# EAGLE schematic Schematic_v2_2 (EAGLE 9.6.2)
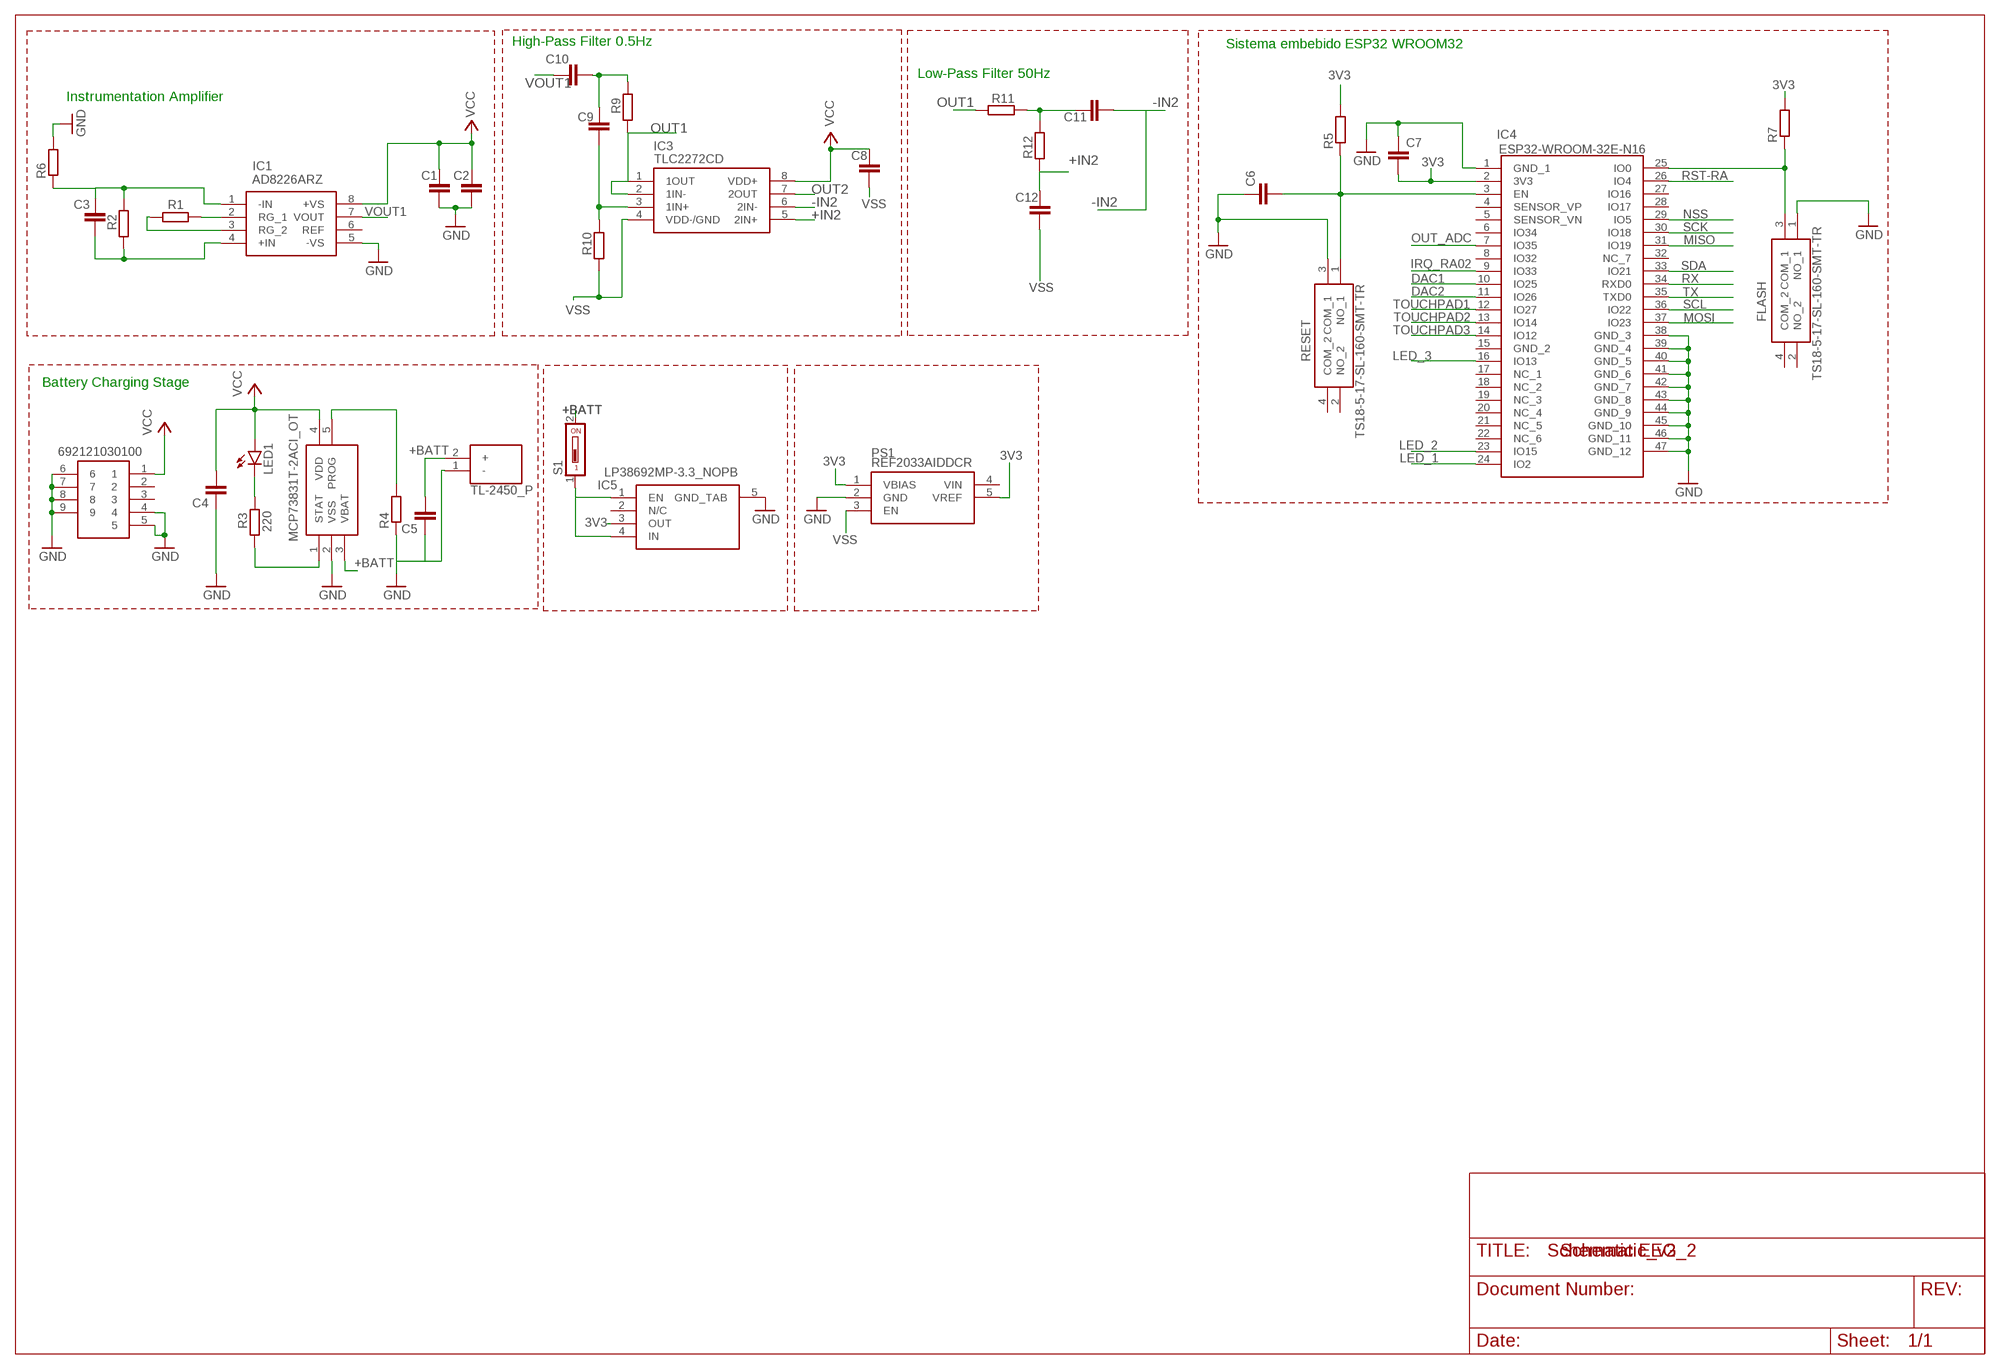
[diagram p0: schematic, sheet 1]

## Parts
BT1  TL-2450_P  [TL2450P]
C1  C-EUC0805  [C0805]
C2  C-EUC0805  [C0805]
C3  C-EUC0805  [C0805]
C4  C-EUC0805  [C0805]
C5  C-EUC0805  [C0805]
C6  C-EUC0805  [C0805]
C7  C-EUC0805  [C0805]
C8  C-EUC0805  [C0805]
C9  C-EUC0805  [C0805]
C10  C-EUC0805  [C0805]
C11  C-EUC0805  [C0805]
C12  C-EUC0805  [C0805]
FLASH  TS18-5-17-SL-160-SMT-TR  [TS18517SL160SMTTR]
IC1  AD8226ARZ  [SOIC127P600X175-8N]
IC2  MCP73831T-2ACI_OT  [SOT95P270X145-5N]
IC3  TLC2272CD  [SOIC127P600X175-8N]
IC4  ESP32-WROOM-32E-N16  [ESP32WROOM32EN16]
IC5  LP38692MP-3.3_NOPB  [SOT150P700X180-5N]
J1  692121030100  [692121030100]
LED1  LEDCHIP-LED0805  [CHIP-LED0805]
PS1  REF2033AIDDCR  [SOT95P280X110-5N]
R1  R-EU_R0805  [R0805]
R2  R-EU_R0805  [R0805]
R3  220  R-EU_R0805  [R0805]
R4  R-EU_R0805  [R0805]
R5  R-EU_R0805  [R0805]
R6  R-EU_R0805  [R0805]
R7  R-EU_R0805  [R0805]
R9  R-EU_R0805  [R0805]
R10  R-EU_R0805  [R0805]
R11  R-EU_R0805  [R0805]
R12  R-EU_R0805  [R0805]
RESET  TS18-5-17-SL-160-SMT-TR  [TS18517SL160SMTTR]
S1  DS01  [DS-01]

## Nets
3V3: C7.2 IC4.2(3V3) IC5.3(OUT) PS1.1(VBIAS) PS1.5(VREF) R5.2 R7.2
+BATT: BT1.2(+) C5.2 IC2.3(VBAT) S1.2
+IN2: C12.1 IC3.5(2IN+) R12.1
-IN2: C11.2 IC3.6(2IN-)
DAC1: IC4.10(IO25)
DAC2: IC4.11(IO26)
GND: C1.2 C2.2 C4.1 C6.1 C7.1 FLASH.1(NO_1) IC1.5(-VS) IC2.2(VSS) IC4.1(GND_1) IC4.38(GND_3) IC4.39(GND_4) IC4.40(GND_5) IC4.41(GND_6) IC4.42(GND_7) IC4.43(GND_8) IC4.44(GND_9) IC4.45(GND_10) IC4.46(GND_11) IC4.47(GND_12) IC5.5(GND_TAB) J1.4 J1.5 J1.6 J1.7 J1.8 J1.9 PS1.2(GND) R4.1 R6.2 RESET.3(COM_1)
IRQ_RA02: IC4.9(IO33)
LED_1: IC4.24(IO2)
LED_2: IC4.23(IO15)
LED_3: IC4.16(IO13)
MISO: IC4.31(IO19)
MOSI: IC4.37(IO23)
N$1: IC1.2(RG_1) R1.2
N$2: IC1.3(RG_2) R1.1
N$3: C3.1 IC1.1(-IN) R2.2 R6.1
N$4: C3.2 IC1.4(+IN) R2.1
N$5: C11.1 R11.2 R12.2
N$6: IC2.1(STAT) R3.1
N$7: IC2.5(PROG) R4.2
N$8: LED1.C R3.2
N$10: FLASH.3(COM_1) IC4.25(IO0) R7.1
N$11: C6.2 IC4.3(EN) R5.1 RESET.1(NO_1)
N$12: C9.2 IC3.3(1IN+) R10.2
N$13: IC5.4(IN) S1.1
N$14: C5.1
N$15: IC5.1(EN)
N$16: BT1.1(-)
NSS: IC4.29(IO5)
OUT1: IC3.1(1OUT) IC3.2(1IN-) R9.1 R11.1
OUT2: C9.1 C10.2 IC3.7(2OUT) R9.2
OUT_ADC: IC4.7(IO35)
RST-RA: IC4.26(IO4)
RX: IC4.34(RXD0)
SCK: IC4.30(IO18)
SCL: IC4.36(IO22)
SDA: IC4.33(IO21)
TOUCHPAD1: IC4.12(IO27)
TOUCHPAD2: IC4.13(IO14)
TOUCHPAD3: IC4.14(IO12)
TX: IC4.35(TXD0)
VCC: C1.1 C2.1 C4.2 C8.1 IC1.8(+VS) IC2.4(VDD) IC3.8(VDD+) J1.1 LED1.A
VOUT1: C10.1 IC1.7(VOUT)
VSS: C8.2 C12.2 IC3.4(VDD-/GND) PS1.3(EN) R10.1
Unconnected: FLASH.2(NO_2) FLASH.4(COM_2) IC1.6(REF) IC4.4(SENSOR_VP) IC4.5(SENSOR_VN) IC4.6(IO34) IC4.8(IO32) IC4.15(GND_2) IC4.17(NC_1) IC4.18(NC_2) IC4.19(NC_3) IC4.20(NC_4) IC4.21(NC_5) IC4.22(NC_6) IC4.27(IO16) IC4.28(IO17) IC4.32(NC_7) IC5.2(N/C) J1.2 J1.3 RESET.2(NO_2) RESET.4(COM_2)

## Notes on the sheet
- High-Pass Filter 0.5Hz | Sistema embebido ESP32 WROOM32
- Low-Pass Filter 50Hz
- Instrumentation Amplifier
- Battery Charging Stage
- Schematic EEG

## Power pins joined to a net without a drawn wire
VIN: PS1.4(VIN)

## Library data of the parts
BT1 = TL-2450_P:TL-2450_P: Lithium Battery Coin 3.6V 550mAh Primary Automotive Through Hole Source: Datasheet <https://datasheet.datasheetarchive.com/originals/distributors/Datasheets-DGA19/42266.pdf>; ARROW_PART_NUMBER: TL-2450/P; ARROW_PRICE-STOCK: http://www.arrow.com/en/products/tl-2450p/tadiran-batteries; DESCRIPTION: Lithium Battery Coin 3.6V 550mAh Primary Automotive Through Hole; HEIGHT: 5.8mm; MANUFACTURER_NAME: Tadiran Batteries; MANUFACTURER_PART_NUMBER: TL-2450/P
C1-C12 = rcl:C-EU: CAPACITOR, European symbol; SPICEPREFIX: C
FLASH RESET = TS18-5-17-SL-160-SMT-TR:TS18-5-17-SL-160-SMT-TR: 5 x 5 mm, 1.7 mm Actuator Height, 160 gf, Silver, Surface Mount, TR, SPST, Tactile Switch Source: Datasheet <https://www.sameskydevices.com/product/resource/supplyframepdf/ts18.pdf>; DESCRIPTION: 5 x 5 mm, 1.7 mm Actuator Height, 160 gf, Silver, Surface Mount, TR, SPST, Tactile Switch; HEIGHT: 1.8mm; MANUFACTURER_NAME: Same Sky; MANUFACTURER_PART_NUMBER: TS18-5-17-SL-160-SMT-TR; MOUSER_PART_NUMBER: 179-TS18517SL160SMTT; MOUSER_PRICE-STOCK: https://www.mouser.co.uk/ProductDetail/CUI-Devices/TS18-5-17-SL-160-SMT-TR?qs=tlsG%2FOw5FFhWy38y3t272A%3D%3D
IC1 = AD8226ARZ:AD8226ARZ: Wide Supply Range, Rail-to-Rail Output Instrumentation Amplifier Source: Datasheet <http://componentsearchengine.com/Datasheets/3/AD8226ARZ.pdf>; DESCRIPTION: Wide Supply Range, Rail-to-Rail Output Instrumentation Amplifier; HEIGHT: 1.75mm; MANUFACTURER_NAME: Analog Devices; MANUFACTURER_PART_NUMBER: AD8226ARZ; MOUSER_PART_NUMBER: 584-AD8226ARZ; MOUSER_PRICE-STOCK: https://www.mouser.co.uk/ProductDetail/Analog-Devices/AD8226ARZ?qs=%2FtpEQrCGXCzihJADRPlhCg%3D%3D
IC2 = MCP73831T-2ACI_OT:MCP73831T-2ACI_OT: Li-Ion Charge Controller 4.2V SOT23-5 Source: Datasheet <http://ww1.microchip.com/downloads/en/DeviceDoc/20001984g.pdf>; ARROW_PART_NUMBER: MCP73831T-2ACI/OT; ARROW_PRICE-STOCK: https://www.arrow.com/en/products/mcp73831t-2aciot/microchip-technology?utm_currency=USD&region=nac; DESCRIPTION: Li-Ion Charge Controller 4.2V SOT23-5; HEIGHT: 1.45mm; MANUFACTURER_NAME: Microchip; MANUFACTURER_PART_NUMBER: MCP73831T-2ACI/OT; MOUSER_PART_NUMBER: 579-MCP73831T-2ACIOT; MOUSER_PRICE-STOCK: https://www.mouser.co.uk/ProductDetail/Microchip-Technology/MCP73831T-2ACI-OT?qs=yUQqVecv4qvbBQBGbHx0Mw%3D%3D
IC3 = TLC2272CD:TLC2272CD: Dual, Low-Noise, Rail-To-Rail Operational Amplifier Source: Datasheet <http://www.ti.com/lit/ds/symlink/tlc2272.pdf>; DESCRIPTION: Dual, Low-Noise, Rail-To-Rail Operational Amplifier; HEIGHT: 1.75mm; MANUFACTURER_NAME: Texas Instruments; MANUFACTURER_PART_NUMBER: TLC2272CD; MOUSER_PART_NUMBER: 595-TLC2272CD; MOUSER_PRICE-STOCK: https://www.mouser.co.uk/ProductDetail/Texas-Instruments/TLC2272CD?qs=JHHQeKcAU3DCCrMZYsil2w%3D%3D
IC4 = ESP32-WROOM-32E-N16:ESP32-WROOM-32E-N16: Bluetooth, WiFi 802.11b/g/n, Bluetooth v4.2 +EDR, Class 1, 2 and 3 Transceiver Module 2.4GHz ~ 2.5GHz Integrated, Trace Surface Mount Source: Datasheet <https://www.espressif.com/sites/default/files/documentation/esp32-wroom-32e_esp32-wroom-32ue_datasheet_en.pdf>; DESCRIPTION: Bluetooth, WiFi 802.11b/g/n, Bluetooth v4.2 +EDR, Class 1, 2 and 3 Transceiver Module 2.4GHz ~ 2.5GHz Integrated, Trace Surface Mount; HEIGHT: 3.25mm; MANUFACTURER_NAME: Espressif Systems; MANUFACTURER_PART_NUMBER: ESP32-WROOM-32E-N16; MOUSER_PART_NUMBER: 356-ESP32WRM32E128PH; MOUSER_PRICE-STOCK: https://www.mouser.co.uk/ProductDetail/Espressif-Systems/ESP32-WROOM-32E-N16?qs=Li%252BoUPsLEnsC4cA%252BUYB2Bw%3D%3D
IC5 = LP38692MP-3.3_NOPB:LP38692MP-3.3_NOPB: LP38692MP-3.3/NOPB, Low Dropout Voltage Regulator, 1A, 3.3 V +/-2.5%, 2.7 10 Vin, 5-Pin SOT-223 Source: Datasheet <http://www.ti.com/lit/ds/symlink/lp38692.pdf>; DESCRIPTION: LP38692MP-3.3/NOPB, Low Dropout Voltage Regulator, 1A, 3.3 V +/-2.5%, 2.7 10 Vin, 5-Pin SOT-223; HEIGHT: 1.8mm; MANUFACTURER_NAME: Texas Instruments; MANUFACTURER_PART_NUMBER: LP38692MP-3.3/NOPB; MOUSER_PART_NUMBER: 926-LP38692MP3.3NOPB; MOUSER_PRICE-STOCK: https://www.mouser.co.uk/ProductDetail/Texas-Instruments/LP38692MP-3.3-NOPB?qs=1FNqv8aZn1TpKuOP2NKBdg%3D%3D
J1 = 692121030100:692121030100: WR-COM USB 3.0 Connector A horizontal Wurth Elektronik WR-COM Series, Right Angle Version 3.0 Type A USB Connector, Through Hole Socket, 30 V ac, 0.25A Source: Datasheet <https://datasheet.datasheetarchive.com/originals/distributors/Datasheets_SAMA/3db0012f6a0c115a48193fa8a30716eb.pdf>; DESCRIPTION: WR-COM USB 3.0 Connector A horizontal Wurth Elektronik WR-COM Series, Right Angle Version 3.0 Type A USB Connector, Through Hole Socket, 30 V ac, 0.25A; HEIGHT: mm; MANUFACTURER_NAME: Wurth Elektronik; MANUFACTURER_PART_NUMBER: 692121030100; MOUSER_PART_NUMBER: 710-692121030100; MOUSER_PRICE-STOCK: https://www.mouser.co.uk/ProductDetail/Wurth-Elektronik/692121030100?qs=e5m3IbTHPW%252BzU%252B9ZpCsp%2Fg%3D%3D
LED1 = led:LED: LED OSRAM: - CHIPLED LG R971, LG N971, LY N971, LG Q971, LY Q971, LO R971, LY R971 LH N974, LH R974 LS Q976, LO Q976, LY Q976 LO Q996 - Hyper CHIPLED LW Q18S LB Q993, LB Q99A, LB R99A - SideLED LS A670, LO A670, LY A670, LG A670, LP A670 LB A673, LV A673, LT A673, LW A673 LH A674 LY A675 LS A676, LA A676, LO A676, LY A676, LW A676 LS A679, LY A679, LG A679 - Hyper Micro SIDELED® LS Y876, LA Y876, LO Y876, LY Y876 LT Y87S - SmartLED LW L88C, LW L88S LB L89C, LB L89S, LG L890 LS L89K, LO L89K, LY L89K LS L896, LA L896, LO L896, LY L896 - TOPLED LS T670, LO T670, LY T670, LG T670, LP T670 LSG T670, LSP T670, LSY T670, LOP T670, LYG T670 LG T671, LOG T671, LSG T671 LB T673, LV T673, LT T673, LW T673 LH T674 LS T676, LA T676, LO T676, LY T676, LB T676, LH T676, LSB T676, LW T676 LB T67C, LV T67C, LT T67C, LS T67K, LO T67K, LY T67K, LW E67C LS E67B, LA E67B, LO E67B, LY E67B, LB E67C, LV E67C, LT E67C LW T67C LS T679, LY T679, LG T679 LS T770, LO T770, LY T770, LG T770, LP T770 LB T773, LV T773, LT T773, LW T773 LH T774 LS E675, LA E675, LY E675, LS T675 LS T776, LA T776, LO T776, LY T776, LB T776 LHGB T686 LT T68C, LB T68C - Hyper Mini TOPLED® LB M676 - Mini TOPLED Santana® LG M470 LS M47K, LO M47K, LY M47K Source: http://www.osram.convergy.de LUXEON: - LUMILED® LXK2-PW12-R00, LXK2-PW12-S00, LXK2-PW14-U00, LXK2-PW14-V00 LXK2-PM12-R00, LXK2-PM12-S00, LXK2-PM14-U00 LXK2-PE12-Q00, LXK2-PE12-R00, LXK2-PE12-S00, LXK2-PE14-T00, LXK2-PE14-U00 LXK2-PB12-K00, LXK2-PB12-L00, LXK2-PB12-M00, LXK2-PB14-N00, LXK2-PB14-P00, LXK2-PB14-Q00 LXK2-PR12-L00, LXK2-PR12-M00, LXK2-PR14-Q00, LXK2-PR14-R00 LXK2-PD12-Q00, LXK2-PD12-R00, LXK2-PD12-S00 LXK2-PH12-R00, LXK2-PH12-S00 LXK2-PL12-P00, LXK2-PL12-Q00, LXK2-PL12-R00 Source: www.luxeon.com KINGBRIGHT: KA-3528ASYC Source: www.kingbright.com
PS1 = REF2033AIDDCR:REF2033AIDDCR: Low-Drift, Low-Power, Dual-Output Vref and Vref/2 Voltage Reference Source: Datasheet <http://www.ti.com/lit/ds/symlink/ref2033.pdf>; DESCRIPTION: Low-Drift, Low-Power, Dual-Output Vref and Vref/2 Voltage Reference; HEIGHT: 1.1mm; MANUFACTURER_NAME: Texas Instruments; MANUFACTURER_PART_NUMBER: REF2033AIDDCR; MOUSER_PART_NUMBER: 595-REF2033AIDDCR; MOUSER_PRICE-STOCK: https://www.mouser.co.uk/ProductDetail/Texas-Instruments/REF2033AIDDCR?qs=7z%252BmIopC6%2FKHHOBVNaL7UQ%3D%3D
R1-R7 R9-R12 = rcl:R-EU_: RESISTOR, European symbol; SPICEPREFIX: R
S1 = switch-dil:DS01: DIL/CODE SWITCH; OC_FARNELL: unknown; OC_NEWARK: unknown